# Altium schematic sheet Analog.SchDoc
size A; SheetNumber: 1; SheetTotal: 4
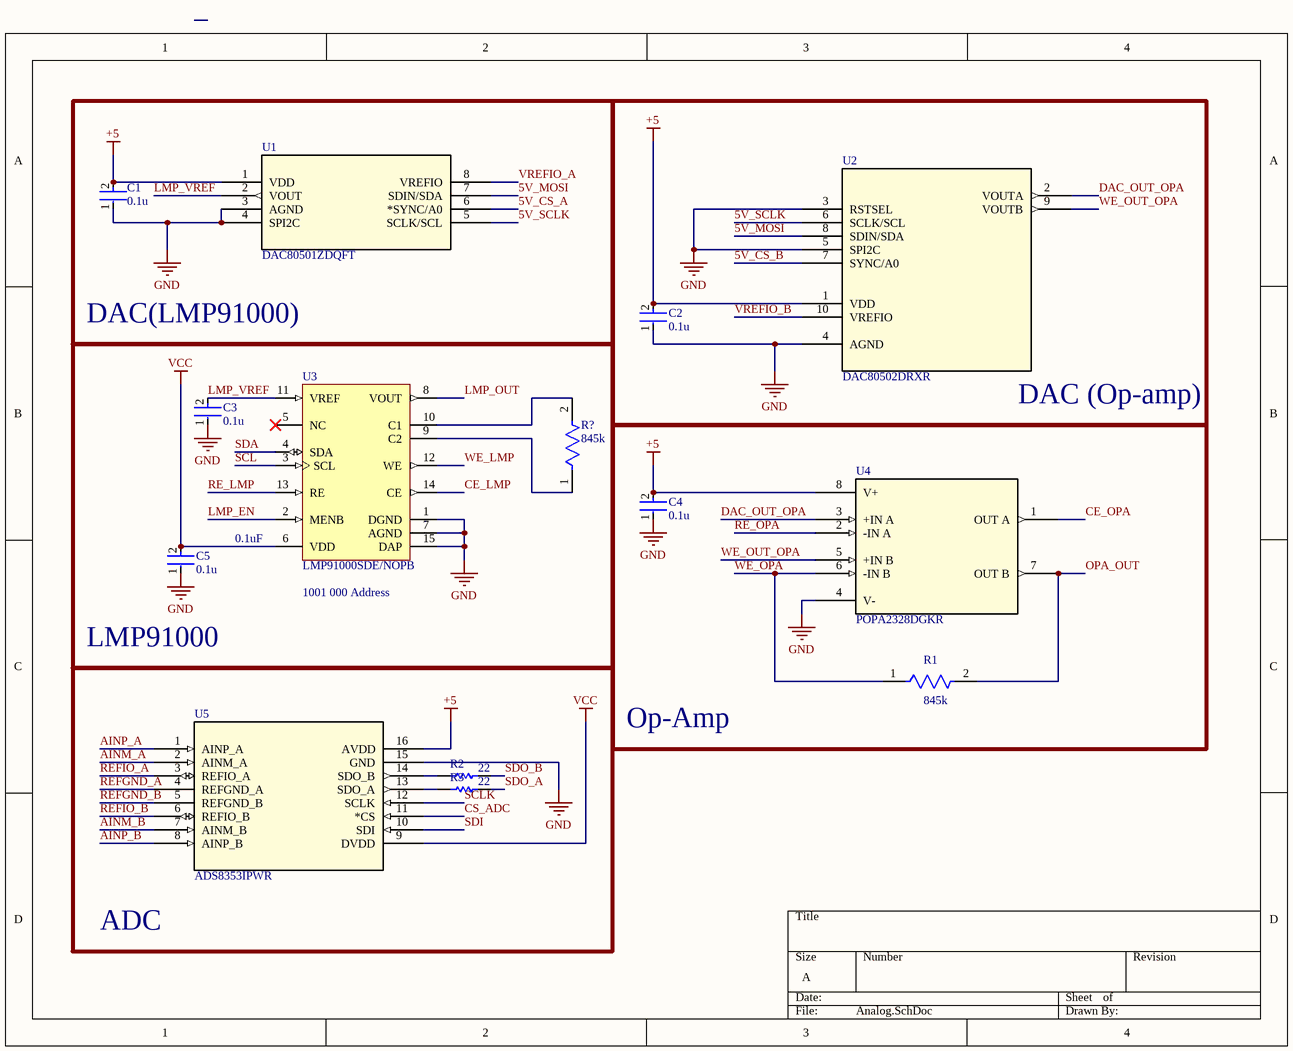
[diagram p0: Analog.SchDoc]

## Parts
C1  0.1u  [FP-GCJ188-0_2-IPC_C]
C2  0.1u  [FP-GCJ188-0_2-IPC_C]
C3  0.1u  [FP-GCJ188-0_2-IPC_C]
C4  0.1u  [FP-GCJ188-0_2-IPC_C]
C5  0.1u  [FP-GCJ188-0_2-IPC_C]
R1  845k  [FP-CR0603-IPC_B]
R2  22  [RESC1608X55X25LL10T15]
R3  22  [RESC1608X55X25LL10T15]
R?  845k  [FP-CR0603-IPC_B]
U1  DAC80501ZDQFT  [WSON8_2P1X2P1_TEX]
U2  DAC80502DRXR  [SON_02DRXR_TEX]
U3  LMP91000SDE/NOPB  [NHL0014B_V]
U4  POPA2328DGKR  [SO8_DGK_TEX]
U5  ADS8353IPWR  [PW16_TEX]

## Blocks framed on the sheet
DAC(LMP91000): C1 U1
DAC (Op-amp): C2 U2
LMP91000: C3 C5 R? U3
Op-Amp: C4 R1 U4

## Nets
+5: C1.2 C2.2 C4.2 U1.1(VDD) U2.1(VDD) U4.8(V+) U5.16(AVDD)
GND: C1.1 C2.1 C3.1 C4.1 C5.1 U1.3(AGND) U1.4(SPI2C) U2.3(RSTSEL) U2.4(AGND) U2.5(SPI2C) U3.1(DGND) U3.7(AGND) U3.15(DAP) U4.4(V-) U5.15(GND)
VCC: C5.2 U3.6(VDD) U5.9(DVDD)
5V_CS_A: U1.6(*SYNC/A0)
5V_CS_B: U2.7(SYNC/A0)
5V_MOSI: U1.7(SDIN/SDA) U2.8(SDIN/SDA)
5V_SCLK: U1.5(SCLK/SCL) U2.6(SCLK/SCL)
AINM_A: U5.2(AINM_A)
AINM_B: U5.7(AINM_B)
AINP_A: U5.1(AINP_A)
AINP_B: U5.8(AINP_B)
CE_LMP: U3.14(CE)
CE_OPA: U4.1(OUT_A)
CS_ADC: U5.11(*CS)
DAC_OUT_OPA: U2.2(VOUTA) U4.3(+IN_A)
LMP_EN: U3.2(MENB)
LMP_OUT: U3.8(VOUT)
LMP_VREF: C3.2 U1.2(VOUT) U3.11(VREF)
OPA_OUT: R1.2 U4.7(OUT_B)
RE_LMP: U3.13(RE)
RE_OPA: U4.2(-IN_A)
REFGND_A: U5.4(REFGND_A)
REFGND_B: U5.5(REFGND_B)
REFIO_A: U5.3(REFIO_A)
REFIO_B: U5.6(REFIO_B)
SCL: U3.3(SCL)
SCLK: U5.12(SCLK)
SDA: U3.4(SDA)
SDI: U5.10(SDI)
SDO_A: R3.2
SDO_B: R2.2
VREFIO_A: U1.8(VREFIO)
VREFIO_B: U2.10(VREFIO)
WE_LMP: U3.12(WE)
WE_OPA: R1.1 U4.6(-IN_B)
WE_OUT_OPA: U2.9(VOUTB) U4.5(+IN_B)
NetR2_1: R2.1 U5.14(SDO_B)
NetR3_1: R3.1 U5.13(SDO_A)
NetR?_1: R?.1 U3.9(C2)
NetR?_2: R?.2 U3.10(C1)

Not connected (* = marked no-connect by the designer): U3 5(NC)*

## Notes on the sheet
- 0.1uF
- (near U3) 1001 000 Address
- ADC

## Library data of the parts
C1-C5 = CMP-2006-02223-2: Cap Ceramic 0.1uF 50V X7R 10% Pad SMD 0603 Soft Termination +125°C Automotive T/R; Capacitance: 100nF; Radiation Hardening: No; Dielectric: X7R; Voltage Rating (DC): 50V; Case Code (Imperial): 0603; Length: 1.6mm; Features: Soft Termination; Case Code (Metric): 1608; Case/Package: 0603; Termination: SMD/SMT; Packaging: Tape and Reel; Height: 0.8mm; Tolerance: 10%; Thickness: 0.035inch; Width: 0.031inch; Voltage Rating: 50V; Min Operating Temperature: -55°C; Ratings: AEC-Q200; Package Quantity: 1; Depth: 0.8mm; Mount: Surface Mount; Lead Free: Lead Free; Max Operating Temperature: 125°C
R1 R? = CMP-07231-001938-1: Thick Film Chip Resistors 0603 845kΩ 0.1W 1% 100ppm/°C; Voltage Rating: 50V; Power Rating: 100mW; Resistance: 845kR; Contact Plating: Tin; Case/Package: 0603; Tolerance: 1%; Case Code (Metric): 1608; Termination: SMD/SMT; Min Operating Temperature: -55°C; Depth: 0.8mm; Mount: Surface Mount; Max Operating Temperature: 155°C; Thickness: 457um; Military Standard: Not; Height: 0.45mm; Radiation Hardening: No; Length: 1.6mm; Temperature Coefficient: 100ppm/°C; Case Code (Imperial): 0603; Package Quantity: 5000; Width: 0.8mm; Composition: Thick Film; Packaging: Tape and Reel
R2 R3 = CMP-2000-04180-1: Manufacturer: Yageo; Part Number: RC0603FR-1022RL
U1 = DAC80501ZDQFT: True 16-bit, 1-ch, SPI/I2C, voltage-output DAC in WSON package with precision internal reference; Mfr_Name: Texas Instruments; RefDes: RefDes; Type: Type; Supplier 1: Mouser; Supplier Part Number 1: 595-DAC80501ZDQFT
U2 = DAC80502DRXR: Dual-channel, 1-LSB INL, 16-bit, SPI voltage-output digital-to-analog converter (DAC); Mfr_Name: Texas Instruments; RefDes: RefDes; Type: Type; Supplier 1: Digikey; Supplier Part Number 1: 296-DAC80502DRXTCT-ND
U3 = CMP-0064-00201-2: Configurable AFE Potentiostat for Low-Power Chemical Sensing Applications, 14-pin LLP, 250 Reel; Manufacturer: Texas Instruments; PowerWise: N; PackageTopMarking: NS*UZXYTT*L91000; CompType: OtherParts; PackageDescription: LLP, Plastic, Dual, 4 x 4 x 0.8mm Body, 14 Lead, 0.5mm Pitch, No Pullback; ComponentLink1URL: http://www.ti.com/general/docs/lit/getliterature.tsp?genericPartNumber=LMP91000&fileType=pdf; ComponentLink1Description: Datasheet URL; PinCount: 14; RoHS: Y; PackageReference: NHL0014B
U4 = POPA2328DGKR: Dual-channel, precision, 50-µV offset voltage, 40-MHz wide-bandwidth RRIO CMOS op amp; Mfr_Name: Texas Instruments; RefDes: RefDes; Type: Type; Supplier 1: Mouser; Supplier Part Number 1: 595-OPA2328DGKR
U5 = ADS8353IPWR: 16-bit 600-kSPS 2-channel simultaneous-sampling SAR ADC with single-ended inputs; Mfr_Name: Texas Instruments; RefDes: RefDes; Type: Type; Supplier 1: Mouser; Supplier Part Number 1: 595-ADS8353IPWR